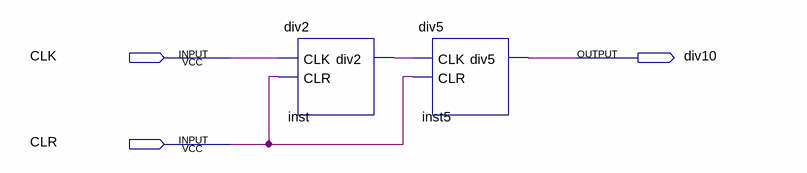
[diagram p0: schematic sheet]
// Quartus schematic div10.bdf as structural Verilog: 2 symbols, 3 pins
module div10 (
  input  CLK,
  input  CLR,
  output div10
);

  wire inst_div2;

  div2 inst (.CLK(CLK), .CLR(CLR), .div2(inst_div2));
  div5 inst5 (.CLK(inst_div2), .CLR(CLR), .div5(div10));
endmodule
